# Altium schematic sheet usb.schdoc: SoRad: Universal Serial Bus Interface
size B; Author: Chris Hiszpanski
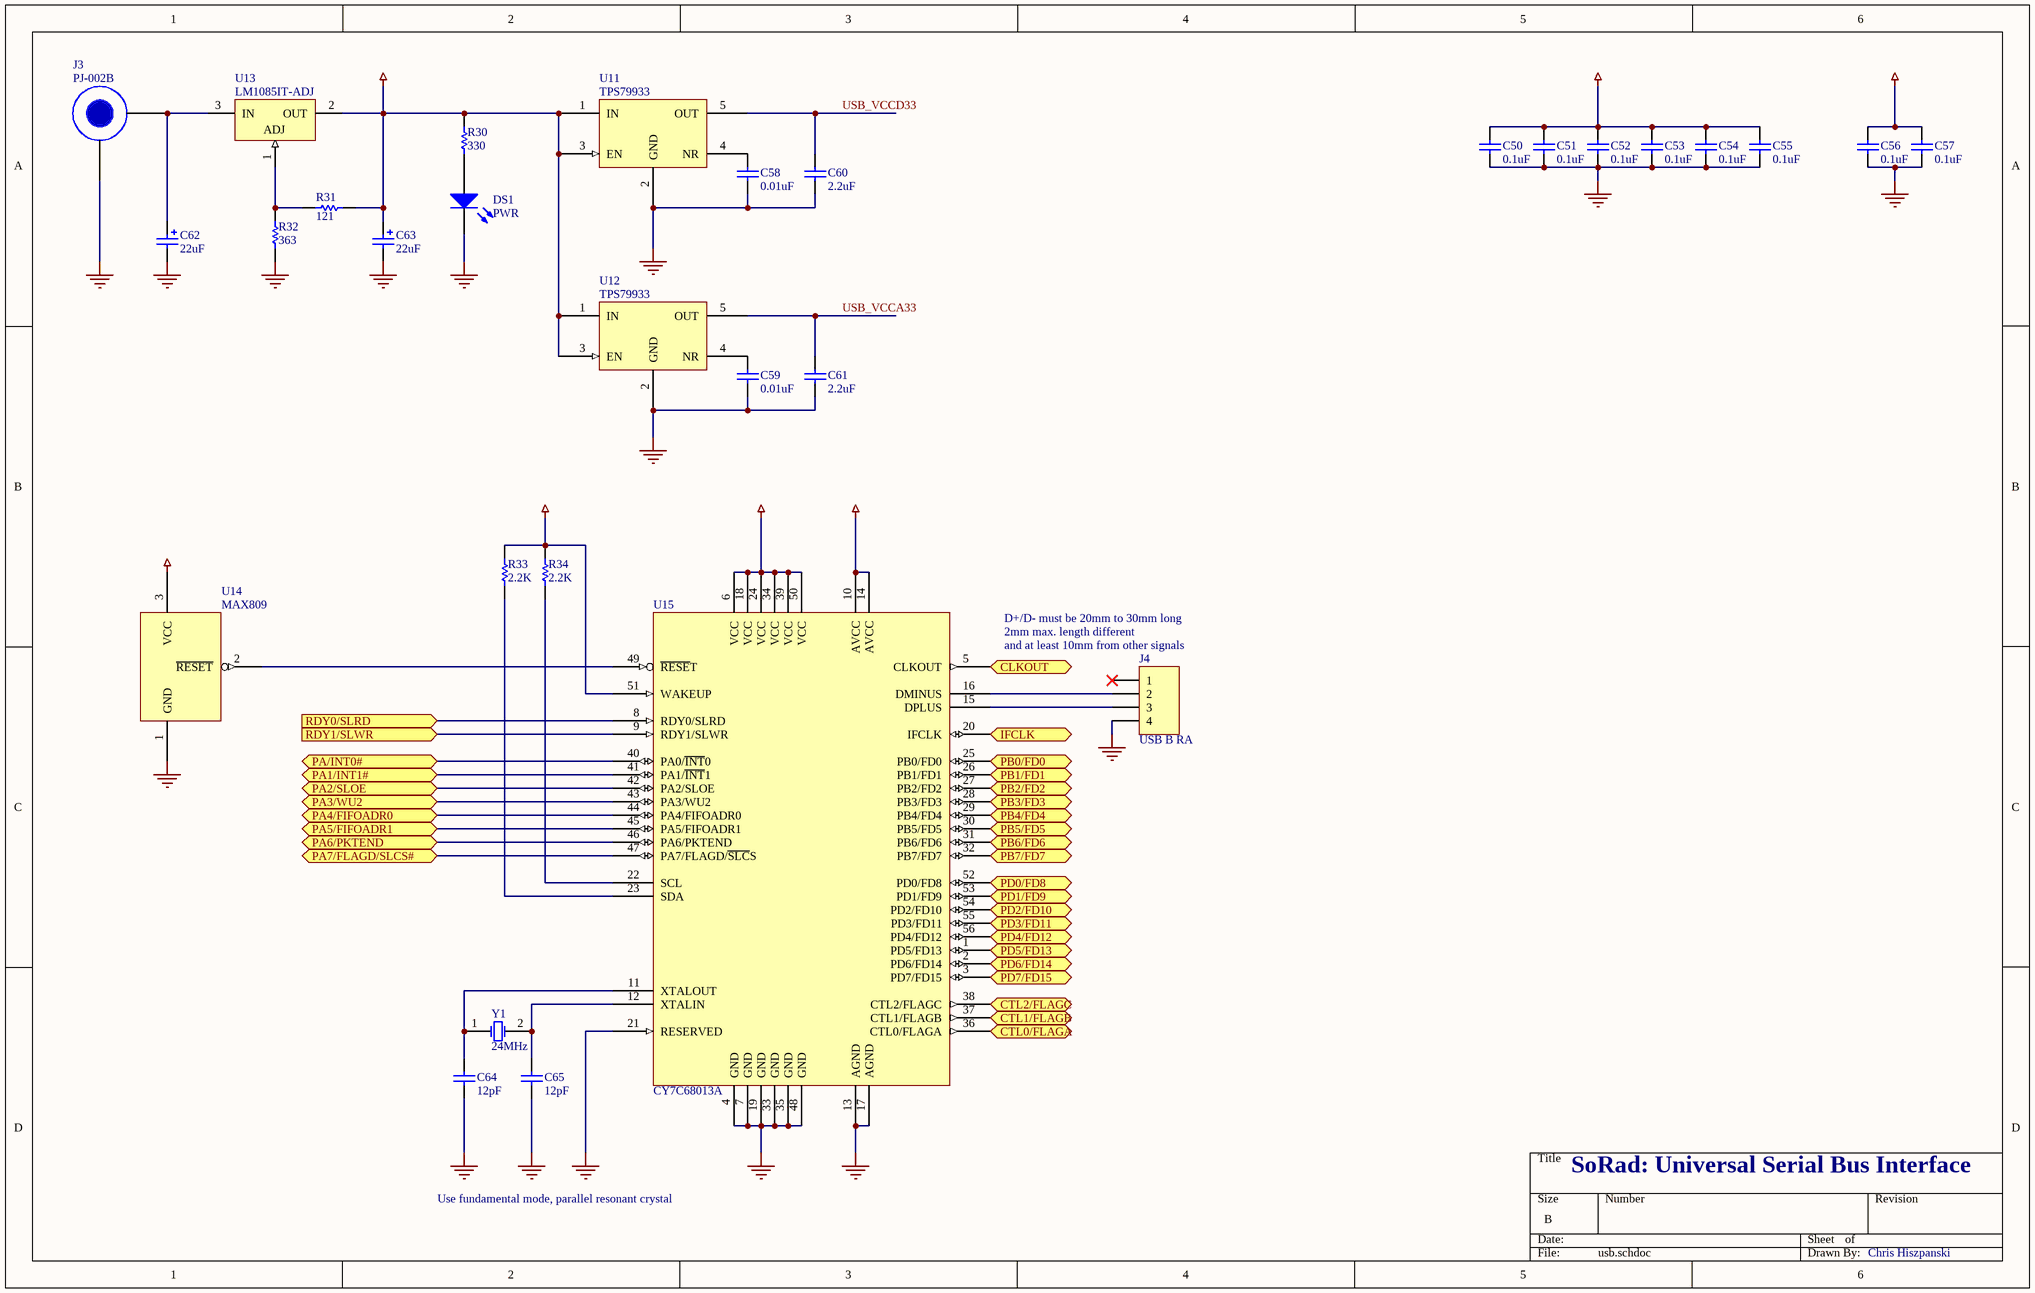
[diagram p0: usb.schdoc]

## Parts
C50  0.1uF  [CC2012-0805]
C51  0.1uF  [CC2012-0805]
C52  0.1uF  [CC2012-0805]
C53  0.1uF  [CC2012-0805]
C54  0.1uF  [CC2012-0805]
C55  0.1uF  [CC2012-0805]
C56  0.1uF  [CC2012-0805]
C57  0.1uF  [CC2012-0805]
C58  0.01uF  [CC2012-0805]
C59  0.01uF  [CC2012-0805]
C60  2.2uF  [CC3216-1206]
C61  2.2uF  [CC3216-1206]
C62  22uF  [RB6.3]
C63  22uF  [RB6.3]
C64  12pF  [CC2012-0805]
C65  12pF  [CC2012-0805]
DS1  PWR  [CC2012-0805]
J3  PJ-002B  [PJ-002B]
J4  USB B RA  [AU-Y1007-R]
R30  330  [CR2012-0805]
R31  121  [CC2012-0805]
R32  363  [CC2012-0805]
R33  2.2K  [CC2012-0805]
R34  2.2K  [CC2012-0805]
U11  TPS79933  [SO-G5/P.95]
U12  TPS79933  [SO-G5/P.95]
U13  LM1085IT-ADJ  [SFM-T3/A4.7V]
U14  MAX809  [SOT-23-3]
U15  CY7C68013A  [SSOP56]
Y1  24MHz  [HC49US]

## Ports
CLKOUT (out), CTL0/FLAGA (out), CTL1/FLAGB (out), CTL2/FLAGC (out), IFCLK (bidir), PA1/INT1# (bidir), PA2/SLOE (bidir), PA3/WU2 (bidir), PA4/FIFOADR0 (bidir), PA5/FIFOADR1 (bidir), PA6/PKTEND (bidir), PA7/FLAGD/SLCS# (bidir), PA/INT0# (bidir), PB0/FD0 (bidir), PB1/FD1 (bidir), PB2/FD2 (bidir), PB3/FD3 (bidir), PB4/FD4 (bidir), PB5/FD5 (bidir), PB6/FD6 (bidir), PB7/FD7 (bidir), PD0/FD8 (bidir), PD1/FD9 (bidir), PD2/FD10 (bidir), PD3/FD11 (bidir), PD4/FD12 (bidir), PD5/FD13 (bidir), PD6/FD14 (bidir), PD7/FD15 (bidir), RDY0/SLRD (in), RDY1/SLWR (in)

## Nets
GND: C50.1 C51.1 C52.1 C53.1 C54.1 C55.1 C56.1 C57.1 C58.1 C59.1 C60.1 C61.1 C62.2 C63.2 C64.1 C65.1 DS1.2(K) J3.2(GND) J4.4 R32.1 U11.2(GND) U12.2(GND) U14.1(GND) U15.4(GND) U15.7(GND) U15.13(AGND) U15.17(AGND) U15.19(GND) U15.21(RESERVED) U15.33(GND) U15.35(GND) U15.48(GND)
USB_VCCA33: C56.2 C57.2 C61.2 U12.5(OUT) U15.10(AVCC) U15.14(AVCC)
USB_VCCD33: C50.2 C51.2 C52.2 C53.2 C54.2 C55.2 C60.2 R33.2 R34.2 U11.5(OUT) U14.3(VCC) U15.6(VCC) U15.18(VCC) U15.24(VCC) U15.34(VCC) U15.39(VCC) U15.50(VCC) U15.51(WAKEUP)
VCC5: C63.1 R30.2 R31.2 U11.1(IN) U11.3(EN) U12.1(IN) U12.3(EN) U13.2(OUT)
CLKOUT: U15.5(CLKOUT) ; port CLKOUT
CTL0/FLAGA: U15.36(CTL0/FLAGA) ; port CTL0/FLAGA
CTL1/FLAGB: U15.37(CTL1/FLAGB) ; port CTL1/FLAGB
CTL2/FLAGC: U15.38(CTL2/FLAGC) ; port CTL2/FLAGC
IFCLK: U15.20(IFCLK) ; port IFCLK
PA1/INT1#: U15.41(PA1/~{INT}1) ; port PA1/INT1#
PA2/SLOE: U15.42(PA2/SLOE) ; port PA2/SLOE
PA3/WU2: U15.43(PA3/WU2) ; port PA3/WU2
PA4/FIFOADR0: U15.44(PA4/FIFOADR0) ; port PA4/FIFOADR0
PA5/FIFOADR1: U15.45(PA5/FIFOADR1) ; port PA5/FIFOADR1
PA6/PKTEND: U15.46(PA6/PKTEND) ; port PA6/PKTEND
PA7/FLAGD/SLCS#: U15.47(PA7/FLAGD/~{SLC}S) ; port PA7/FLAGD/SLCS#
PA/INT0#: U15.40(PA0/~{INT}0) ; port PA/INT0#
PB0/FD0: U15.25(PB0/FD0) ; port PB0/FD0
PB1/FD1: U15.26(PB1/FD1) ; port PB1/FD1
PB2/FD2: U15.27(PB2/FD2) ; port PB2/FD2
PB3/FD3: U15.28(PB3/FD3) ; port PB3/FD3
PB4/FD4: U15.29(PB4/FD4) ; port PB4/FD4
PB5/FD5: U15.30(PB5/FD5) ; port PB5/FD5
PB6/FD6: U15.31(PB6/FD6) ; port PB6/FD6
PB7/FD7: U15.32(PB7/FD7) ; port PB7/FD7
PD0/FD8: U15.52(PD0/FD8) ; port PD0/FD8
PD1/FD9: U15.53(PD1/FD9) ; port PD1/FD9
PD2/FD10: U15.54(PD2/FD10) ; port PD2/FD10
PD3/FD11: U15.55(PD3/FD11) ; port PD3/FD11
PD4/FD12: U15.56(PD4/FD12) ; port PD4/FD12
PD5/FD13: U15.1(PD5/FD13) ; port PD5/FD13
PD6/FD14: U15.2(PD6/FD14) ; port PD6/FD14
PD7/FD15: U15.3(PD7/FD15) ; port PD7/FD15
RDY0/SLRD: U15.8(RDY0/SLRD) ; port RDY0/SLRD
RDY1/SLWR: U15.9(RDY1/SLWR) ; port RDY1/SLWR
NetC58_2: C58.2 U11.4(NR)
NetC59_2: C59.2 U12.4(NR)
NetC62_1: C62.1 J3.1(VCC) U13.3(IN)
NetC64_2: C64.2 U15.11(XTALOUT) Y1.1(OSC1)
NetC65_2: C65.2 U15.12(XTALIN) Y1.2(OSC2)
NetDS1_1: DS1.1(A) R30.1
NetJ4_2: J4.2 U15.16(DMINUS)
NetJ4_3: J4.3 U15.15(DPLUS)
NetR31_1: R31.1 R32.2 U13.1(ADJ)
NetR33_1: R33.1 U15.23(SDA)
NetR34_1: R34.1 U15.22(SCL)
NetU14_2: U14.2(~{RESET}) U15.49(~{RESE}T)

Not connected (* = marked no-connect by the designer): J4 1*

## Notes on the sheet
- D+/D- must be 20mm to 30mm long
- 2mm max. length different
- (near J4) and at least 10mm from other signals
- Use fundamental mode, parallel resonant crystal

## Library data of the parts
C50-C57 = Cap: Capacitor; Manufacturer: Panasonic; Manufacturer Part Number: ECJ-2VF1C104Z; Published: 8-Jun-2000; Revision: July-2002: Re-released for DXP Platform.; Publisher: Altium Limited; Value: 0.1uF; Distributor: Digikey; Distributor Part Number: PCC1843CT-ND
C58 C59 = Cap: Capacitor; Manufacturer: Panasonic; Manufacturer Part Number: ECJ-2VF1H103Z; Published: 8-Jun-2000; Revision: July-2002: Re-released for DXP Platform.; Publisher: Altium Limited; Value: 0.01uF; Distributor: Digikey; Distributor Part Number: PCC1858CT-ND
C60 C61 = Cap: Capacitor; Manufacturer: Panasonic; Manufacturer Part Number: ECJ-3VF1C225Z; Published: 8-Jun-2000; Revision: July-2002: Re-released for DXP Platform.; Publisher: Altium Limited; Value: 2.2uF; Distributor: Digikey; Distributor Part Number: PCC1898CT-ND
C62 C63 = Cap Pol1: Polarized Capacitor (Radial); Manufacturer: Panasonic; Manufacturer Part Number: ECE-A1HKA220; Published: 8-Jun-2000; Revision: July-2002: Re-released for DXP Platform.; Publisher: Altium Limited; Value: 22uF; Distributor: Digikey; Distributor Part Number: P837-ND
C64 C65 = Cap: Capacitor; Manufacturer: Panasonic; Manufacturer Part Number: ECJ-2VC1H120J; Published: 8-Jun-2000; Revision: July-2002: Re-released for DXP Platform.; Publisher: Altium Limited; Value: 12pF; Distributor: Digikey; Distributor Part Number: PCC120CNCT-ND
DS1 = LED0: Typical INFRARED GaAs LED; Manufacturer: Generic Components; Manufacturer: Lumex; Manufacturer Part Number: SML-LXT0805GW-TR; Class I: Optoelectronic; Published: 8-Jun-2000; Revision: July-2002: Re-released for DXP Platform.; Publisher: Altium Limited; Class II: LED; Distributor: Digikey; Distributor Part Number: 67-1553-1-ND
J3 = PB-002B: R/A PCB Mount Power Jack; Manufacturer: CUI; Distributor: Digikey; Distributor Part Number: CP-002B-ND; Manufacturer Part Number: PJ-002B
J4 = Header 4: Header, 4-Pin; Manufacturer: Assmann; Revision: 17-Jul-2002: Re-released for DXP Platform.; Publisher: Altium Limited; Distributor: Digikey; Distributor Part Number: AE9925-ND; Manufacturer Part Number: AU-Y1007-R
R30 = Res1: Resistor; Manufacturer: Generic Components; Manufacturer: Panasonic; Manufacturer Part Number: ERJ-6GEYJ331V; Class I: Passive; Published: 8-Jun-2000; Revision: July-2002: Re-released for DXP Platform.; Publisher: Altium Limited; Class II: Resistor; Value: 330; Distributor: Digikey; Distributor Part Number: P330ACT-ND
R31 R32 = Res1: Resistor; Manufacturer: Generic Components; Class I: Passive; Published: 8-Jun-2000; Revision: July-2002: Re-released for DXP Platform.; Publisher: Altium Limited; Class II: Resistor
  R31: Value: 121
  R32: Value: 363
R33 R34 = Res1: Resistor; Manufacturer: Vishay/Dale; Manufacturer Part Number: CRCW08052K20FKEA; Published: 8-Jun-2000; Revision: July-2002: Re-released for DXP Platform.; Publisher: Altium Limited; Value: 2.2K; Distributor: Digikey; Distributor Part Number: 541-2.20KCCT-ND
U11 U12 = TPS799xx: LDO Voltage Regulator; Manufacturer: Texas Instruments; Manufacturer Part Number: TPS79933DDCR; Distributor: Digikey; Distributor Part Number: 296-17783-1-ND
U13 = LM317HVT: 3-Terminal Adjustable Regulator; Manufacturer: National Semiconductor; Manufacturer Part Number: LM1085IT-ADJ/NOPB; Package Information: Latest Revision: 1995; Class I: Power Management; Class II: Voltage Regulator; Note: Tab is connected to Output; Published: 15-Apr-2002; Datasheet: Latest Revision: May-1999; Package Reference: T03B; Publisher: Altium Limited; Distributor: Digikey; Distributor Part Number: LM1085IT-ADJ-ND
U14 = MAX809: POR Supervisory Circuit; Manufacturer: ON Semiconductor; Manufacturer Part Number: MAX809RTRG; Distributor: Digikey; Distributor Part Number: MAX809RTRGOSCT-ND
U15 = CY7C68013A: EZ-USB FX2LP USB Microcontroller (56-SSOP); Manufacturer: Cypress Microsystems; Manufacturer Part Number: CY7C68013A-56PVXC; Distributor: Digikey; Distributor Part Number: 428-1627-ND
Y1 = XTAL: Crystal Oscillator; Manufacturer: ECS; Manufacturer Part Number: ECS-240-12-4X; Published: 8-Jun-2000; Revision: July-2002: Re-released for DXP Platform.; Publisher: Altium Limited; Distributor: Digikey; Distributor Part Number: XC1005-ND